# EAGLE schematic maxwell (EAGLE 7.1.0)
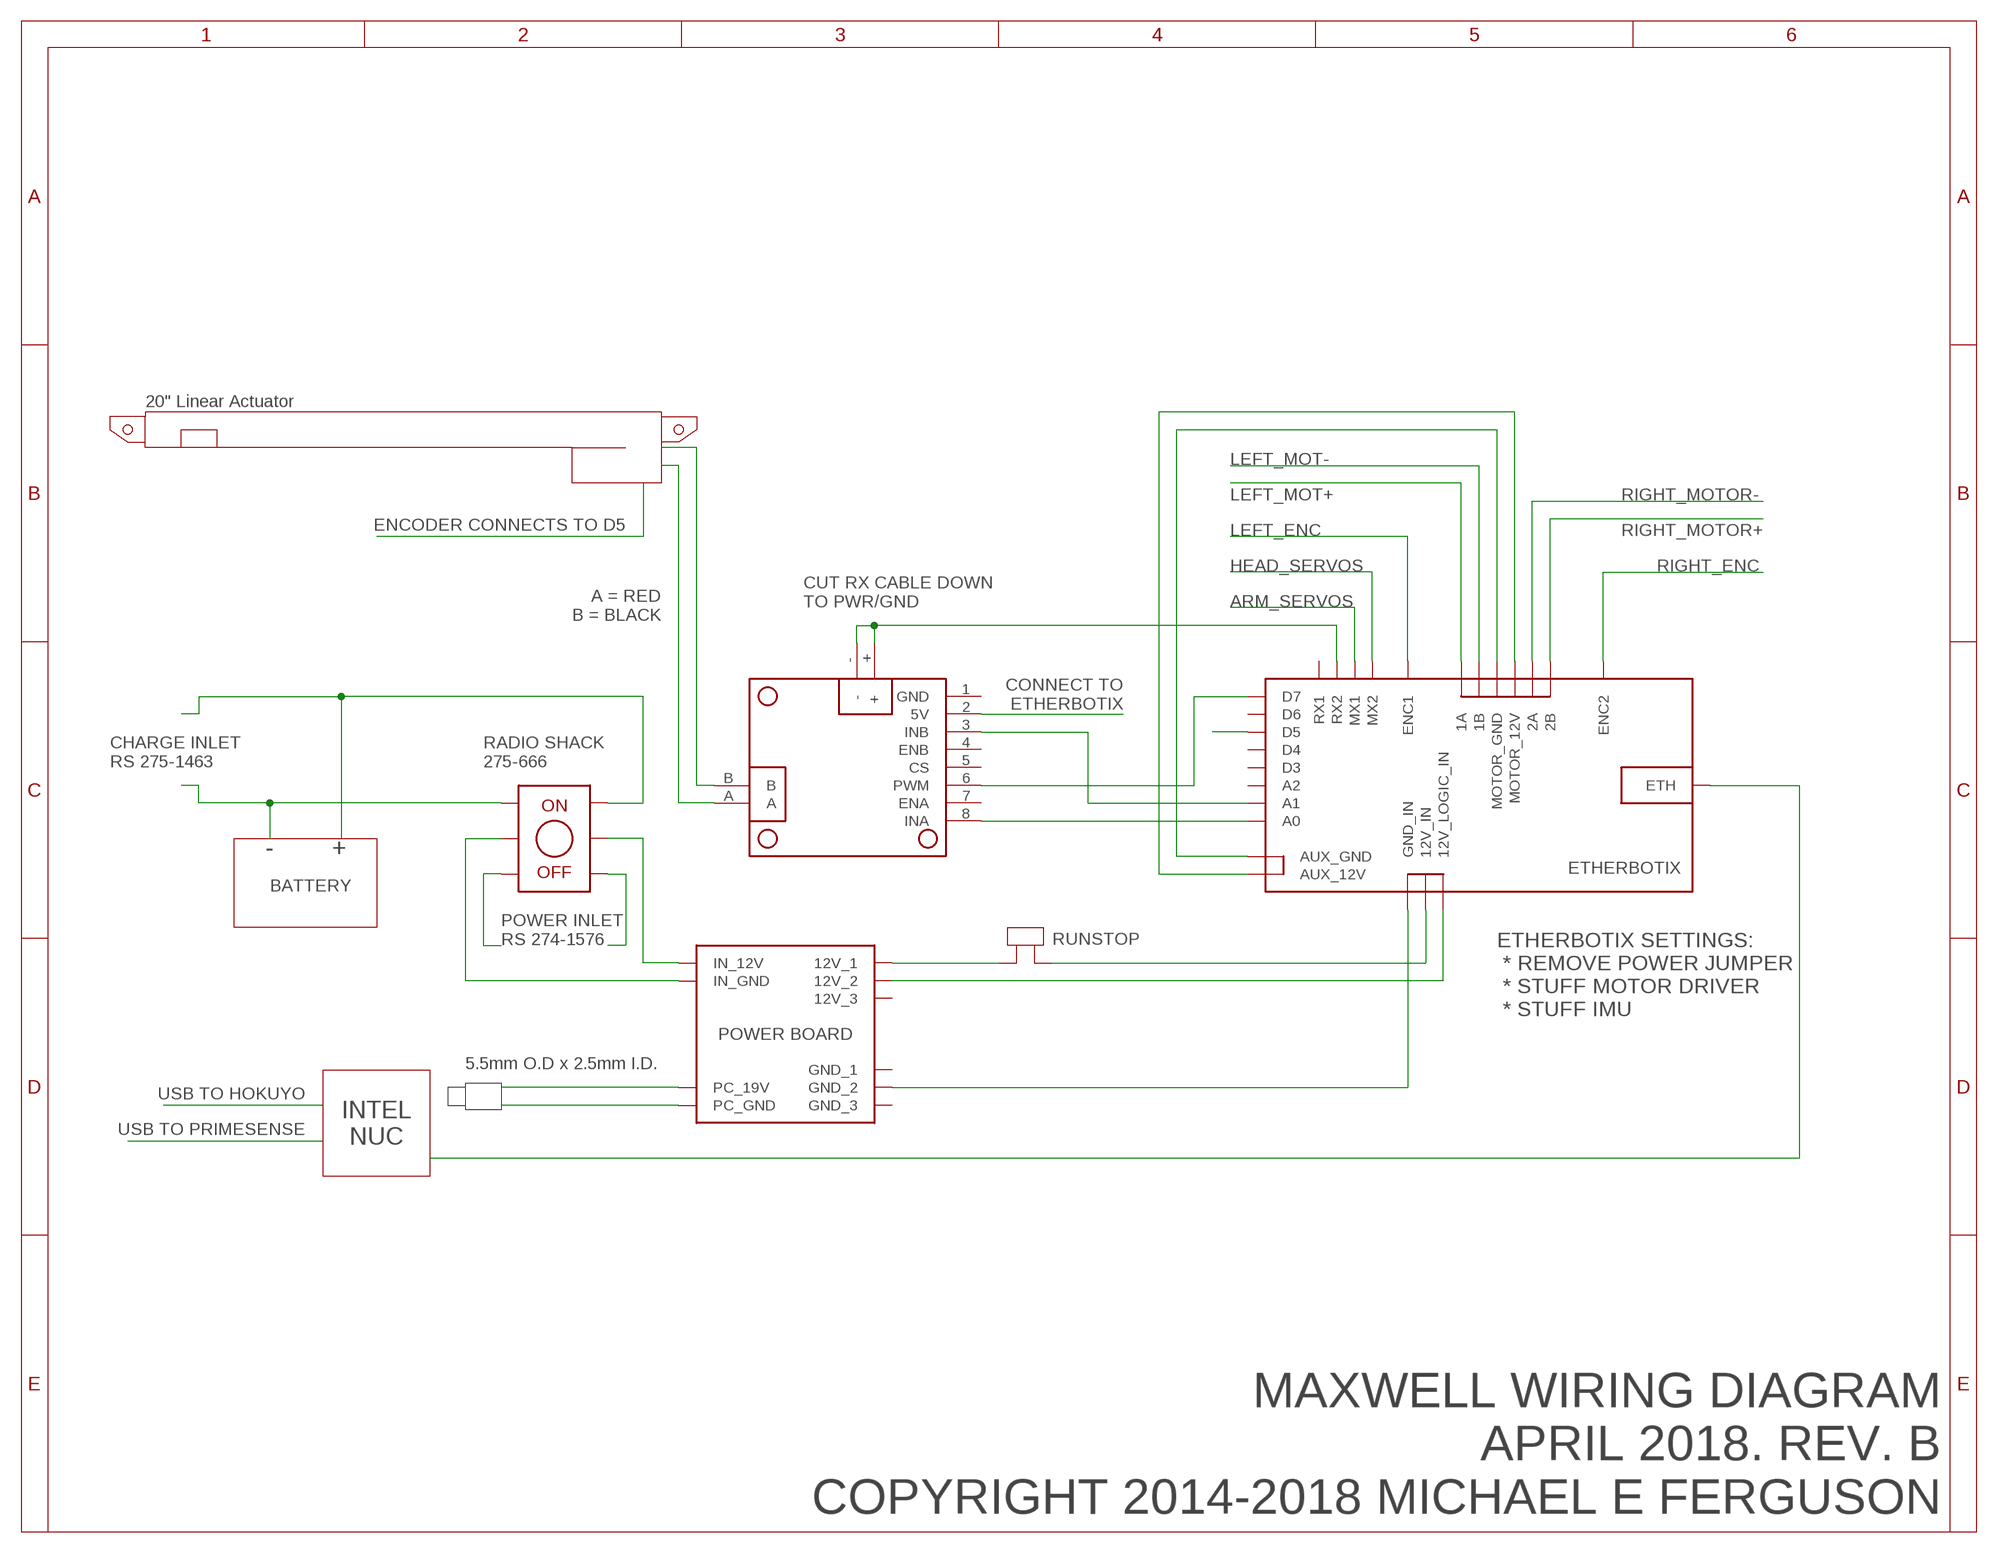
[diagram p0: schematic, sheet 1]

## Parts
U$1  ETHERBOTIX  [CRAP]
U$2  MAXWELL_POWERBOARD  [CRAP]
U$3  RS275-666  [CRAP]
U$4  MD01B  [MD01B]

## Nets
ARM_SERVOS: U$1.P$23(MX1)
HEAD_SERVOS: U$1.P$24(MX2)
LEFT_ENC: U$1.P$17(ENC1)
LEFT_MOT+: U$1.P$1(1A)
LEFT_MOT-: U$1.P$2(1B)
N$1: U$2.P$7(IN_12V) U$3.P$4(B)
N$2: U$1.P$6(12V_LOGIC_IN) U$2.P$2(12V_2)
N$3: U$1.P$20(GND_IN) U$2.P$5(GND_2)
N$4: U$1.P$5(12V_IN)
N$5: U$2.P$1(12V_1)
N$6: U$1.P$11(AUX_GND) U$1.P$22(MOTOR_GND)
N$7: U$1.P$10(AUX_12V) U$1.P$21(MOTOR_12V)
N$8: U$1.P$19(ETH)
N$9: U$2.P$8(IN_GND) U$3.P$1(A)
N$10: U$3.P$2(A0)
N$11: U$3.P$5(B0)
N$12: U$3.P$6(B1)
N$13: U$3.P$3(A1)
N$14: U$2.P$9(PC_19V)
N$15: U$2.P$10(PC_GND)
N$18: U$1.P$7(A0) U$4.8(INA)
N$19: U$1.P$16(D7) U$4.6(PWM)
N$20: U$1.P$8(A1) U$4.3(INB)
N$21: U$1.P$26(RX2) U$4.+ U$4.-
N$22: U$4.B
N$23: U$4.A
N$24: U$1.P$14(D5)
N$26: U$4.2(5V)
RIGHT_ENC: U$1.P$18(ENC2)
RIGHT_MOTOR+: U$1.P$4(2B)
RIGHT_MOTOR-: U$1.P$3(2A)
Unconnected: U$1.P$9(A2) U$1.P$12(D3) U$1.P$13(D4) U$1.P$15(D6) U$1.P$25(RX1) U$2.P$3(12V_3) U$2.P$4(GND_1) U$2.P$6(GND_3) U$4.1(GND) U$4.4(ENB) U$4.5(CS) U$4.7(ENA)

## Notes on the sheet
- 20" Linear Actuator
- ENCODER CONNECTS TO D5
- A = RED
  B = BLACK
- CUT RX CABLE DOWN
  TO PWR/GND
- CONNECT TO
  ETHERBOTIX
- CHARGE INLET
  RS 275-1463
- RADIO SHACK
  275-666
- - | +
- BATTERY
- POWER INLET
  RS 274-1576
- RUNSTOP
- ETHERBOTIX SETTINGS:
   * REMOVE POWER JUMPER
   * STUFF MOTOR DRIVER
   * STUFF IMU
- 5.5mm O.D x 2.5mm I.D.
- USB TO HOKUYO
- USB TO PRIMESENSE
- INTEL
  NUC
- MAXWELL WIRING DIAGRAM
  APRIL 2018. REV. B
  COPYRIGHT 2014-2018 MICHAEL E FERGUSON

## Library data of the parts
U$1 = fergs:ETHERBOTIX
U$2 = fergs:MAXWELL_POWERBOARD
U$3 = fergs:RS275-666: http://www.radioshack.com/product/index.jsp?productId=2062518
U$4 = pololu:MD01B